# EAGLE schematic Nusbio1.0.WaveShare (EAGLE 7.4.0)
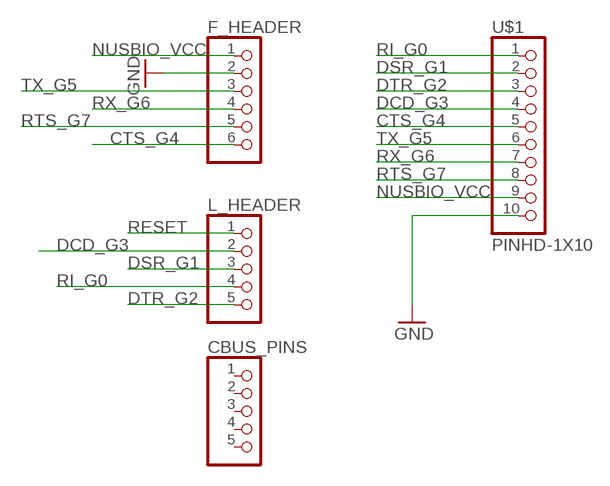
[diagram p0: schematic, sheet 1]

## Parts
CBUS_PINS  PINHD-1X5  [1X05]
F_HEADER  PINHD-1X6  [1X06]
L_HEADER  PINHD-1X5  [1X05]
U$1  PINHD-1X10  [1X10-BIG]

## Nets
CTS_G4: F_HEADER.6 U$1.5
DCD_G3: L_HEADER.2 U$1.4
DSR_G1: L_HEADER.3 U$1.2
DTR_G2: L_HEADER.5 U$1.3
GND: F_HEADER.2 U$1.10
NUSBIO_VCC: F_HEADER.1 U$1.9
RESET: L_HEADER.1
RI_G0: L_HEADER.4 U$1.1
RTS_G7: F_HEADER.5 U$1.8
RX_G6: F_HEADER.4 U$1.7
TX_G5: F_HEADER.3 U$1.6
Unconnected: CBUS_PINS.1 CBUS_PINS.2 CBUS_PINS.3 CBUS_PINS.4 CBUS_PINS.5

## Library data of the parts
CBUS_PINS L_HEADER = pinhead:PINHD-1X5: PIN HEADER
F_HEADER = adafruit:PINHD-1X6: PIN HEADER
U$1 = adafruit:PINHD-1X10: Pin header 1x10 0.1" spacing With round pins